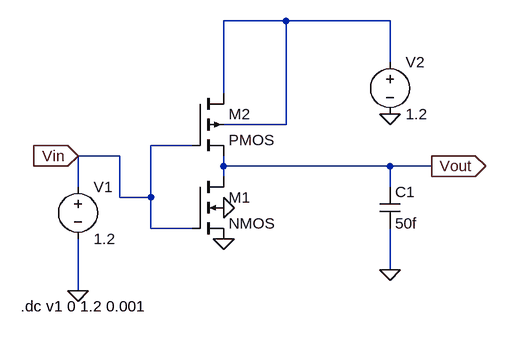
[diagram p0: schematic inverter_90_vtc.asc]
inverter_90_vtc.asc, the LTspice schematic file:
Version 4.1
SHEET 1 880 680
WIRE 272 -80 176 -80
WIRE 432 -80 272 -80
WIRE 432 -16 432 -80
WIRE 176 32 176 -80
WIRE 272 80 272 -80
WIRE 272 80 176 80
WIRE 128 112 64 112
WIRE 16 128 -48 128
WIRE 176 144 176 128
WIRE 432 144 176 144
WIRE 496 144 432 144
WIRE 176 160 176 144
WIRE -48 176 -48 128
WIRE 432 176 432 144
WIRE 16 192 16 128
WIRE 64 192 64 112
WIRE 64 192 16 192
WIRE 64 240 64 192
WIRE 128 240 64 240
WIRE 432 304 432 240
WIRE -48 336 -48 256
FLAG -48 336 0
FLAG 432 64 0
FLAG 176 256 0
FLAG 176 208 0
FLAG 432 304 0
FLAG -48 128 Vin
IOPIN -48 128 In
FLAG 496 144 Vout
IOPIN 496 144 Out
SYMBOL nmos4 128 160 R0
SYMATTR InstName M1
SYMATTR Value2 l=90nm w=135nm
SYMBOL pmos4 128 32 R0
SYMATTR InstName M2
SYMATTR Value2 l=90nm w=405nm
SYMBOL cap 416 176 R0
SYMATTR InstName C1
SYMATTR Value 50f
SYMBOL voltage -48 160 R0
WINDOW 123 0 0 Left 0
WINDOW 39 0 0 Left 0
SYMATTR InstName V1
SYMATTR Value 1.2
SYMBOL voltage 432 -32 R0
WINDOW 123 0 0 Left 0
WINDOW 39 0 0 Left 0
SYMATTR InstName V2
SYMATTR Value 1.2
TEXT -136 360 Left 2 !.dc v1 0 1.2 0.001

The netlist it stands for:
* inverter_90_vtc.asc
M1 Vout Vin 0 0 NMOS l=90nm w=135nm
M2 N001 Vin Vout N001 PMOS l=90nm w=405nm
C1 Vout 0 50f
V1 Vin 0 1.2
V2 N001 0 1.2
.model NMOS NMOS
.model PMOS PMOS
.lib standard.mos
.dc v1 0 1.2 0.001
.backanno
.end